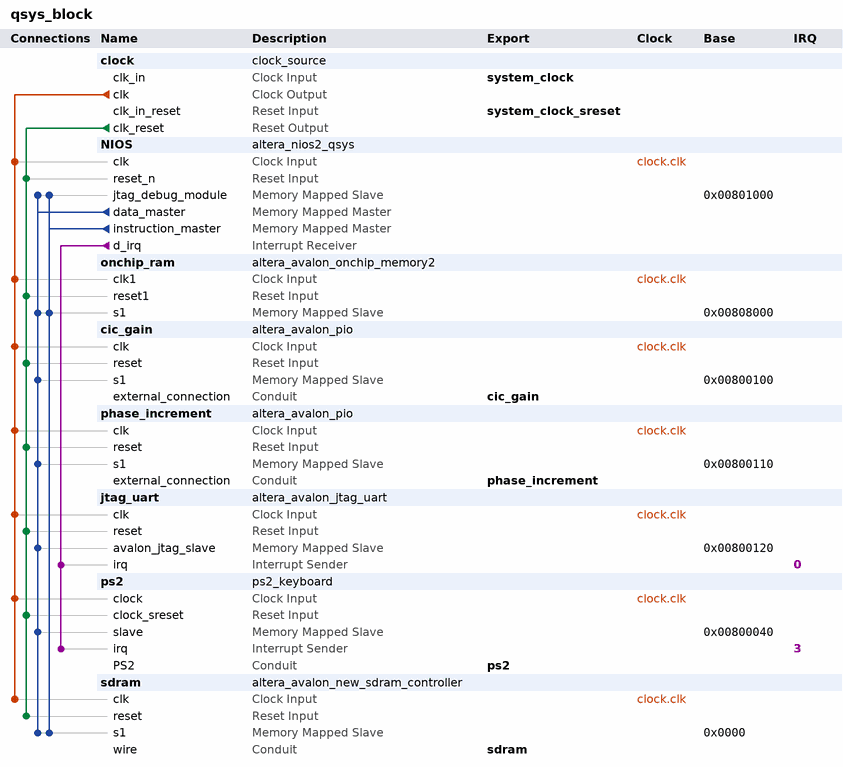
[diagram p0: system contents]
# Platform Designer (Qsys) system qsys_block, Cyclone III EP3C16F484C6
# Parameters at their usual value, and those the tool derives, are not listed.
package require -exact qsys 13.1
create_system qsys_block
set_project_property DEVICE_FAMILY {Cyclone III}
set_project_property DEVICE EP3C16F484C6

add_instance clock clock_source 13.1
set_instance_parameter_value clock clockFrequency 120000000
set_instance_parameter_value clock resetSynchronousEdges BOTH

add_instance NIOS altera_nios2_qsys 13.1
set_instance_parameter_value NIOS resetSlave onchip_ram.s1
set_instance_parameter_value NIOS mmu_TLBMissExcSlave None
set_instance_parameter_value NIOS exceptionSlave onchip_ram.s1
set_instance_parameter_value NIOS breakSlave NIOS.jtag_debug_module
set_instance_parameter_value NIOS impl Tiny
set_instance_parameter_value NIOS icache_size 4096
set_instance_parameter_value NIOS icache_burstType Sequential
set_instance_parameter_value NIOS dcache_size 0

add_instance onchip_ram altera_avalon_onchip_memory2 13.1
set_instance_parameter_value onchip_ram dataWidth 32
set_instance_parameter_value onchip_ram dualPort false
set_instance_parameter_value onchip_ram initMemContent true
set_instance_parameter_value onchip_ram initializationFileName onchip_mem.hex
set_instance_parameter_value onchip_ram memorySize 16384

add_instance cic_gain altera_avalon_pio 13.1
set_instance_parameter_value cic_gain direction Output
set_instance_parameter_value cic_gain width 4

add_instance phase_increment altera_avalon_pio 13.1
set_instance_parameter_value phase_increment direction Output
set_instance_parameter_value phase_increment width 32

add_instance jtag_uart altera_avalon_jtag_uart 13.1
set_instance_parameter_value jtag_uart simInteractiveOptions NO_INTERACTIVE_WINDOWS

add_instance ps2 ps2_keyboard 1.0
set_instance_parameter_value ps2 SYSTEM_CLOCK 100000000

add_instance sdram altera_avalon_new_sdram_controller 13.1
set_instance_parameter_value sdram TAC 5.5
set_instance_parameter_value sdram TRCD 20.0
set_instance_parameter_value sdram TRFC 60.0
set_instance_parameter_value sdram TRP 18.0
set_instance_parameter_value sdram casLatency 3
set_instance_parameter_value sdram columnWidth 8
set_instance_parameter_value sdram dataWidth 16
set_instance_parameter_value sdram generateSimulationModel false
set_instance_parameter_value sdram model single_Micron_MT48LC4M32B2_7_chip
set_instance_parameter_value sdram numberOfBanks 4
set_instance_parameter_value sdram numberOfChipSelects 1
set_instance_parameter_value sdram powerUpDelay 100.0
set_instance_parameter_value sdram refreshPeriod 15.625
set_instance_parameter_value sdram rowWidth 12

# connections
add_connection clock.clk cic_gain.clk clock
add_connection clock.clk jtag_uart.clk clock
add_connection clock.clk NIOS.clk clock
add_connection clock.clk onchip_ram.clk1 clock
add_connection clock.clk phase_increment.clk clock
add_connection clock.clk ps2.clock clock
add_connection clock.clk sdram.clk clock
add_connection clock.clk_reset cic_gain.reset reset
add_connection clock.clk_reset jtag_uart.reset reset
add_connection clock.clk_reset NIOS.reset_n reset
add_connection clock.clk_reset onchip_ram.reset1 reset
add_connection clock.clk_reset phase_increment.reset reset
add_connection clock.clk_reset ps2.clock_sreset reset
add_connection clock.clk_reset sdram.reset reset
add_connection NIOS.data_master cic_gain.s1 avalon
set_connection_parameter_value NIOS.data_master/cic_gain.s1 baseAddress 0x00800100
add_connection NIOS.data_master jtag_uart.avalon_jtag_slave avalon
set_connection_parameter_value NIOS.data_master/jtag_uart.avalon_jtag_slave baseAddress 0x00800120
add_connection NIOS.data_master NIOS.jtag_debug_module avalon
set_connection_parameter_value NIOS.data_master/NIOS.jtag_debug_module baseAddress 0x00801000
add_connection NIOS.data_master onchip_ram.s1 avalon
set_connection_parameter_value NIOS.data_master/onchip_ram.s1 baseAddress 0x00808000
add_connection NIOS.data_master phase_increment.s1 avalon
set_connection_parameter_value NIOS.data_master/phase_increment.s1 baseAddress 0x00800110
add_connection NIOS.data_master ps2.slave avalon
set_connection_parameter_value NIOS.data_master/ps2.slave baseAddress 0x00800040
add_connection NIOS.data_master sdram.s1 avalon
set_connection_parameter_value NIOS.data_master/sdram.s1 baseAddress 0x0000
add_connection NIOS.instruction_master NIOS.jtag_debug_module avalon
set_connection_parameter_value NIOS.instruction_master/NIOS.jtag_debug_module baseAddress 0x00801000
add_connection NIOS.instruction_master onchip_ram.s1 avalon
set_connection_parameter_value NIOS.instruction_master/onchip_ram.s1 baseAddress 0x00808000
add_connection NIOS.instruction_master sdram.s1 avalon
set_connection_parameter_value NIOS.instruction_master/sdram.s1 baseAddress 0x0000
add_connection NIOS.d_irq jtag_uart.irq interrupt
set_connection_parameter_value NIOS.d_irq/jtag_uart.irq irqNumber 0
add_connection NIOS.d_irq ps2.irq interrupt
set_connection_parameter_value NIOS.d_irq/ps2.irq irqNumber 3

# exported interfaces
add_interface system_clock clock sink
set_interface_property system_clock EXPORT_OF clock.clk_in
add_interface system_clock_sreset reset sink
set_interface_property system_clock_sreset EXPORT_OF clock.clk_in_reset
add_interface sdram conduit end
set_interface_property sdram EXPORT_OF sdram.wire
add_interface cic_gain conduit end
set_interface_property cic_gain EXPORT_OF cic_gain.external_connection
add_interface phase_increment conduit end
set_interface_property phase_increment EXPORT_OF phase_increment.external_connection
add_interface ps2 conduit end
set_interface_property ps2 EXPORT_OF ps2.PS2

set_interconnect_requirement {$system} qsys_mm.clockCrossingAdapter HANDSHAKE
set_interconnect_requirement {$system} qsys_mm.maxAdditionalLatency 2
set_interconnect_requirement {mm_interconnect_0|frame_reader_avalon_master_translator_avalon_universal_master_0_agent.cp/addr_router_001.sink} qsys_mm.postTransform.pipelineCount 1
set_interconnect_requirement {mm_interconnect_0|addr_router_001.src/limiter.cmd_sink} qsys_mm.postTransform.pipelineCount 1
set_interconnect_requirement {mm_interconnect_0|cmd_xbar_demux_001.src1/width_adapter_001.sink} qsys_mm.postTransform.pipelineCount 1
set_interconnect_requirement {mm_interconnect_0|width_adapter_001.src/cmd_xbar_mux_003.sink0} qsys_mm.postTransform.pipelineCount 1
set_interconnect_requirement {mm_interconnect_0|cmd_xbar_mux_003.src/burst_adapter_001.sink0} qsys_mm.postTransform.pipelineCount 1
set_interconnect_requirement {mm_interconnect_0|burst_adapter_001.source0/vip_bridge_s0_translator_avalon_universal_slave_0_agent.cp} qsys_mm.postTransform.pipelineCount 1
set_interconnect_requirement {mm_interconnect_0|cmd_xbar_demux_001.src0/crosser.in} qsys_mm.postTransform.pipelineCount 1
set_interconnect_requirement {mm_interconnect_0|crosser.out/cmd_xbar_mux_002.sink1} qsys_mm.postTransform.pipelineCount 1
set_interconnect_requirement {mm_interconnect_0|cmd_xbar_mux_004.src/periph_bridge_s0_translator_avalon_universal_slave_0_agent.cp} qsys_mm.postTransform.pipelineCount 1
set_interconnect_requirement {mm_interconnect_0|cmd_xbar_mux_005.src/frame_reader_avalon_slave_translator_avalon_universal_slave_0_agent.cp} qsys_mm.postTransform.pipelineCount 1
set_interconnect_requirement {mm_interconnect_0|cmd_xbar_mux.src/nios2e_jtag_debug_module_translator_avalon_universal_slave_0_agent.cp} qsys_mm.postTransform.pipelineCount 1
set_interconnect_requirement {mm_interconnect_0|cmd_xbar_mux_001.src/onchip_ram_s1_translator_avalon_universal_slave_0_agent.cp} qsys_mm.postTransform.pipelineCount 1
set_interconnect_requirement {mm_interconnect_0|width_adapter.src/cmd_xbar_mux_002.sink0} qsys_mm.postTransform.pipelineCount 1
set_interconnect_requirement {mm_interconnect_0|width_adapter_002.src/cmd_xbar_mux_002.sink2} qsys_mm.postTransform.pipelineCount 1
set_interconnect_requirement {mm_interconnect_0|cmd_xbar_mux_002.src/burst_adapter.sink0} qsys_mm.postTransform.pipelineCount 1
set_interconnect_requirement {mm_interconnect_0|burst_adapter.source0/sdram_s1_translator_avalon_universal_slave_0_agent.cp} qsys_mm.postTransform.pipelineCount 1
set_interconnect_requirement {mm_interconnect_0|rsp_xbar_mux_002.src/nios2e_data_master_translator_avalon_universal_master_0_agent.rp} qsys_mm.postTransform.pipelineCount 1
set_interconnect_requirement {mm_interconnect_0|width_adapter_004.src/rsp_xbar_mux_002.sink2} qsys_mm.postTransform.pipelineCount 1
set_interconnect_requirement {mm_interconnect_0|width_adapter_003.src/rsp_xbar_mux.sink2} qsys_mm.postTransform.pipelineCount 1
set_interconnect_requirement {mm_interconnect_0|rsp_xbar_demux_004.src0/rsp_xbar_mux_002.sink3} qsys_mm.postTransform.pipelineCount 1
set_interconnect_requirement {mm_interconnect_0|rsp_xbar_mux_003.src/vip_bridge_m0_translator_avalon_universal_master_0_agent.rp} qsys_mm.postTransform.pipelineCount 1
set_interconnect_requirement {mm_interconnect_0|rsp_xbar_demux_001.src1/rsp_xbar_mux_002.sink1} qsys_mm.postTransform.pipelineCount 1
set_interconnect_requirement {mm_interconnect_0|rsp_xbar_demux_001.src0/rsp_xbar_mux.sink1} qsys_mm.postTransform.pipelineCount 1
set_interconnect_requirement {mm_interconnect_0|rsp_xbar_demux.src1/rsp_xbar_mux_002.sink0} qsys_mm.postTransform.pipelineCount 1
set_interconnect_requirement {mm_interconnect_0|rsp_xbar_demux.src0/rsp_xbar_mux.sink0} qsys_mm.postTransform.pipelineCount 1
set_interconnect_requirement {mm_interconnect_0|rsp_xbar_demux_005.src0/rsp_xbar_mux_002.sink4} qsys_mm.postTransform.pipelineCount 1
set_interconnect_requirement {mm_interconnect_0|sdram_s1_translator_avalon_universal_slave_0_agent.rp/id_router_002.sink} qsys_mm.postTransform.pipelineCount 1
set_interconnect_requirement {mm_interconnect_0|id_router_002.src/rsp_xbar_demux_002.sink} qsys_mm.postTransform.pipelineCount 1
set_interconnect_requirement {mm_interconnect_0|rsp_xbar_demux_002.src2/width_adapter_004.sink} qsys_mm.postTransform.pipelineCount 1
set_interconnect_requirement {mm_interconnect_0|rsp_xbar_demux_002.src1/crosser_001.in} qsys_mm.postTransform.pipelineCount 1
set_interconnect_requirement {mm_interconnect_0|rsp_xbar_demux_002.src0/width_adapter_003.sink} qsys_mm.postTransform.pipelineCount 1
set_interconnect_requirement {mm_interconnect_0|crosser_001.out/rsp_xbar_mux_001.sink0} qsys_mm.postTransform.pipelineCount 1
set_interconnect_requirement {mm_interconnect_0|width_adapter_005.src/rsp_xbar_mux_001.sink1} qsys_mm.postTransform.pipelineCount 1
set_interconnect_requirement {mm_interconnect_0|vip_bridge_s0_translator_avalon_universal_slave_0_agent.rp/id_router_003.sink} qsys_mm.postTransform.pipelineCount 1
set_interconnect_requirement {mm_interconnect_0|id_router_003.src/rsp_xbar_demux_003.sink} qsys_mm.postTransform.pipelineCount 1
set_interconnect_requirement {mm_interconnect_0|rsp_xbar_demux_003.src0/width_adapter_005.sink} qsys_mm.postTransform.pipelineCount 1

save_system qsys_block.qsys
